# EAGLE design charliewatch-norf (EAGLE 9.4.0)

## Sheet 1 of 2
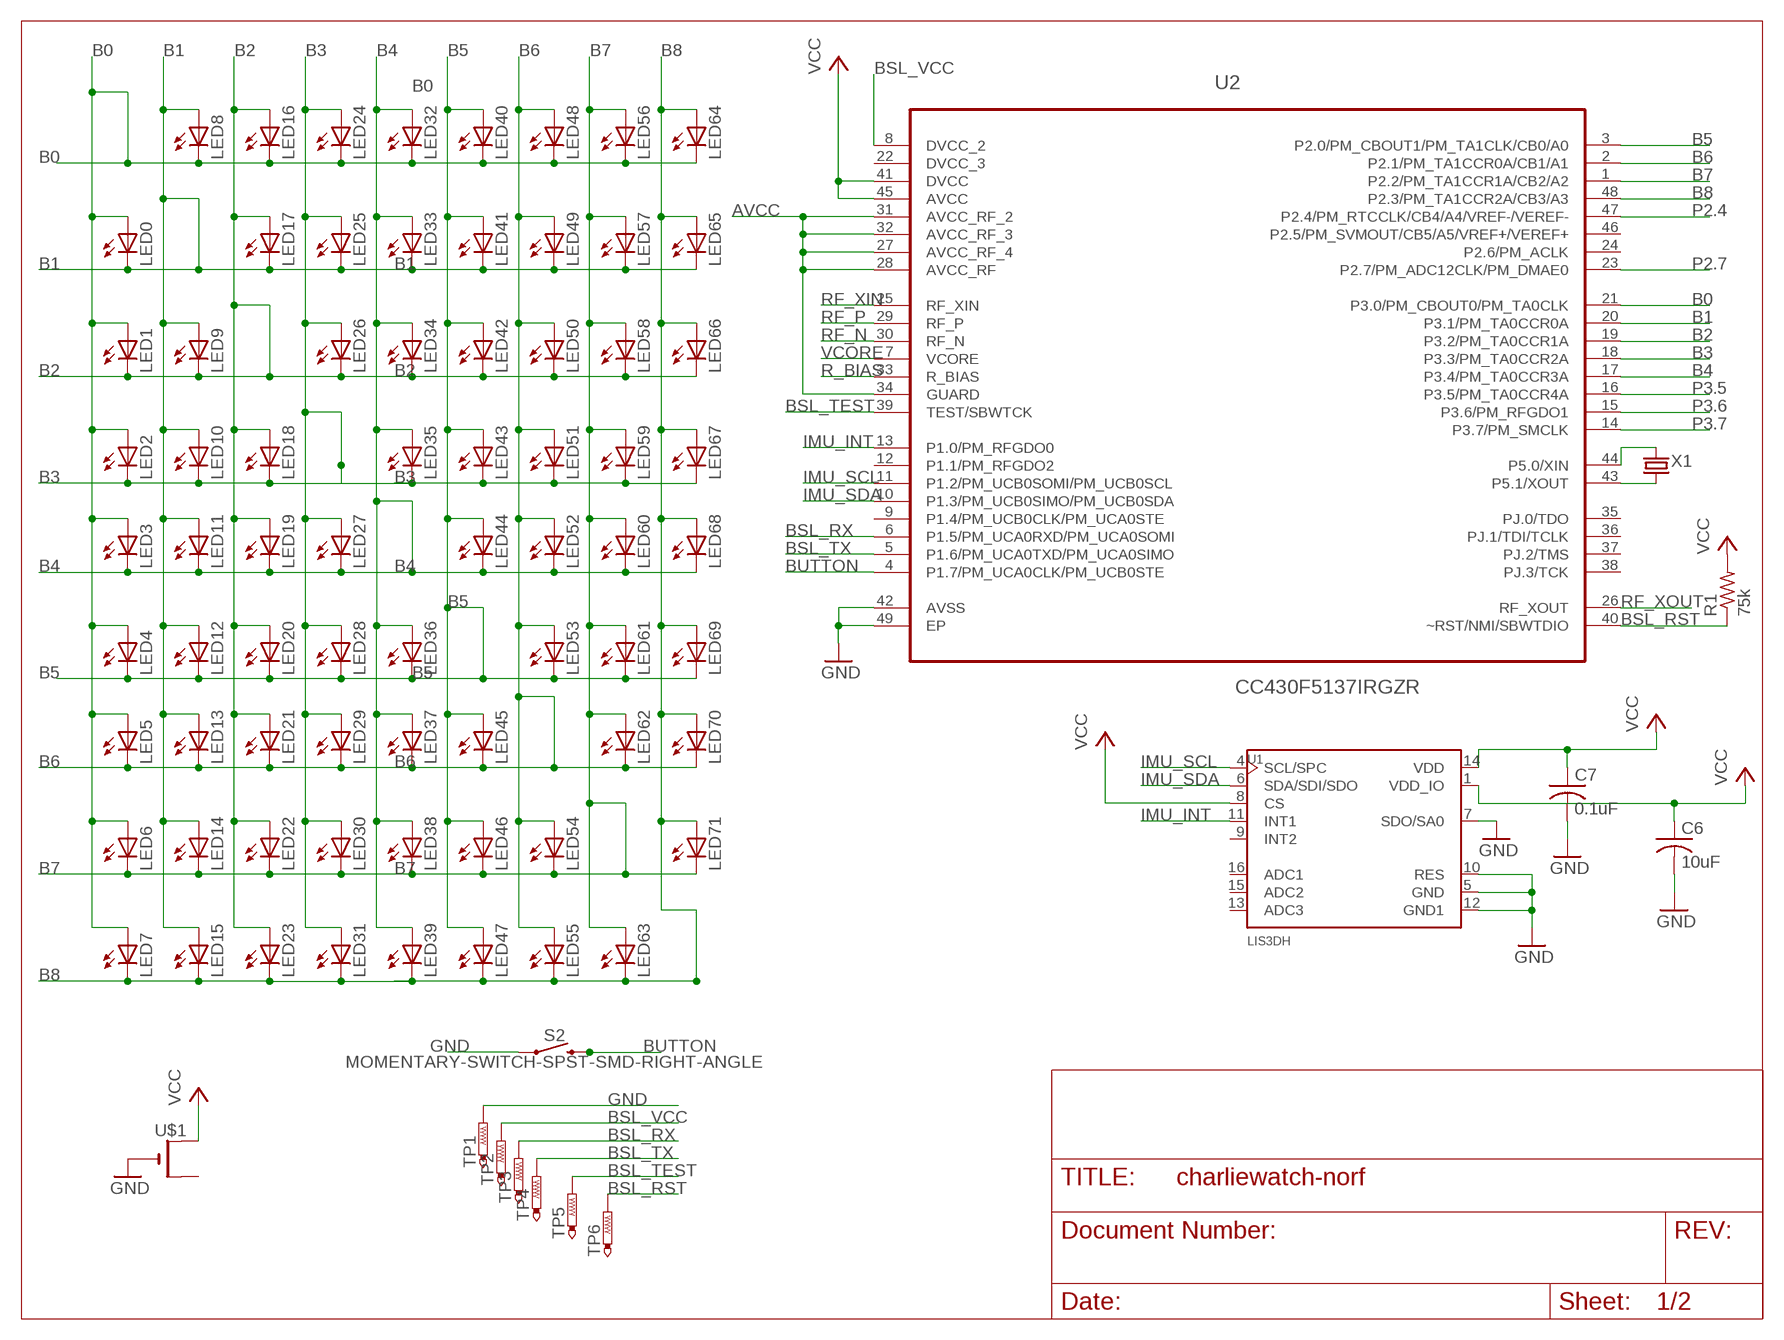
[diagram p0: schematic, sheet 1]

### Parts
C6  10uF  C-USC0603  [C0603]
C7  0.1uF  C-USC0603  [C0603]
LED0  LEDCHIPLED_0603  [CHIPLED_0603]
LED1  LEDCHIPLED_0603  [CHIPLED_0603]
LED2  LEDCHIPLED_0603  [CHIPLED_0603]
LED3  LEDCHIPLED_0603  [CHIPLED_0603]
LED4  LEDCHIPLED_0603  [CHIPLED_0603]
LED5  LEDCHIPLED_0603  [CHIPLED_0603]
LED6  LEDCHIPLED_0603  [CHIPLED_0603]
LED7  LEDCHIPLED_0603  [CHIPLED_0603]
LED8  LEDCHIPLED_0603  [CHIPLED_0603]
LED9  LEDCHIPLED_0603  [CHIPLED_0603]
LED10  LEDCHIPLED_0603  [CHIPLED_0603]
LED11  LEDCHIPLED_0603  [CHIPLED_0603]
LED12  LEDCHIPLED_0603  [CHIPLED_0603]
LED13  LEDCHIPLED_0603  [CHIPLED_0603]
LED14  LEDCHIPLED_0603  [CHIPLED_0603]
LED15  LEDCHIPLED_0603  [CHIPLED_0603]
LED16  LEDCHIPLED_0603  [CHIPLED_0603]
LED17  LEDCHIPLED_0603  [CHIPLED_0603]
LED18  LEDCHIPLED_0603  [CHIPLED_0603]
LED19  LEDCHIPLED_0603  [CHIPLED_0603]
LED20  LEDCHIPLED_0603  [CHIPLED_0603]
LED21  LEDCHIPLED_0603  [CHIPLED_0603]
LED22  LEDCHIPLED_0603  [CHIPLED_0603]
LED23  LEDCHIPLED_0603  [CHIPLED_0603]
LED24  LEDCHIPLED_0603  [CHIPLED_0603]
LED25  LEDCHIPLED_0603  [CHIPLED_0603]
LED26  LEDCHIPLED_0603  [CHIPLED_0603]
LED27  LEDCHIPLED_0603  [CHIPLED_0603]
LED28  LEDCHIPLED_0603  [CHIPLED_0603]
LED29  LEDCHIPLED_0603  [CHIPLED_0603]
LED30  LEDCHIPLED_0603  [CHIPLED_0603]
LED31  LEDCHIPLED_0603  [CHIPLED_0603]
LED32  LEDCHIPLED_0603  [CHIPLED_0603]
LED33  LEDCHIPLED_0603  [CHIPLED_0603]
LED34  LEDCHIPLED_0603  [CHIPLED_0603]
LED35  LEDCHIPLED_0603  [CHIPLED_0603]
LED36  LEDCHIPLED_0603  [CHIPLED_0603]
LED37  LEDCHIPLED_0603  [CHIPLED_0603]
LED38  LEDCHIPLED_0603  [CHIPLED_0603]
LED39  LEDCHIPLED_0603  [CHIPLED_0603]
LED40  LEDCHIPLED_0603  [CHIPLED_0603]
LED41  LEDCHIPLED_0603  [CHIPLED_0603]
LED42  LEDCHIPLED_0603  [CHIPLED_0603]
LED43  LEDCHIPLED_0603  [CHIPLED_0603]
LED44  LEDCHIPLED_0603  [CHIPLED_0603]
LED45  LEDCHIPLED_0603  [CHIPLED_0603]
LED46  LEDCHIPLED_0603  [CHIPLED_0603]
LED47  LEDCHIPLED_0603  [CHIPLED_0603]
LED48  LEDCHIPLED_0603  [CHIPLED_0603]
LED49  LEDCHIPLED_0603  [CHIPLED_0603]
LED50  LEDCHIPLED_0603  [CHIPLED_0603]
LED51  LEDCHIPLED_0603  [CHIPLED_0603]
LED52  LEDCHIPLED_0603  [CHIPLED_0603]
LED53  LEDCHIPLED_0603  [CHIPLED_0603]
LED54  LEDCHIPLED_0603  [CHIPLED_0603]
LED55  LEDCHIPLED_0603  [CHIPLED_0603]
LED56  LEDCHIPLED_0603  [CHIPLED_0603]
LED57  LEDCHIPLED_0603  [CHIPLED_0603]
LED58  LEDCHIPLED_0603  [CHIPLED_0603]
LED59  LEDCHIPLED_0603  [CHIPLED_0603]
LED60  LEDCHIPLED_0603  [CHIPLED_0603]
LED61  LEDCHIPLED_0603  [CHIPLED_0603]
LED62  LEDCHIPLED_0603  [CHIPLED_0603]
LED63  LEDCHIPLED_0603  [CHIPLED_0603]
LED64  LEDCHIPLED_0603  [CHIPLED_0603]
LED65  LEDCHIPLED_0603  [CHIPLED_0603]
LED66  LEDCHIPLED_0603  [CHIPLED_0603]
LED67  LEDCHIPLED_0603  [CHIPLED_0603]
LED68  LEDCHIPLED_0603  [CHIPLED_0603]
LED69  LEDCHIPLED_0603  [CHIPLED_0603]
LED70  LEDCHIPLED_0603  [CHIPLED_0603]
LED71  LEDCHIPLED_0603  [CHIPLED_0603]
R1  75k  R-US_R0402  [R0402]
S2  MOMENTARY-SWITCH-SPST-SMD-RIGHT-ANGLE  [TACTILE_SWITCH_SMD_RIGHT_ANGLE]
TP1  PTR1TP10SQ  [TP10SQ]
TP2  PTR1TP10R  [TP10R]
TP3  PTR1TP10R  [TP10R]
TP4  PTR1TP10R  [TP10R]
TP5  PTR1TP10R  [TP10R]
TP6  PTR1TP10R  [TP10R]
U1  LIS3DH  [PQFN50P300X300X100-16N]
U2  CC430F5137IRGZR  [QFN50P700X700X100-49N]
U$1  CR2032SMT  [CR2032-SMD]
X1  CRYSTALS-NOGND-IQXC-25  [2.0X1.2-2PAD]

### Nets
AVCC: U2.27(AVCC_RF_4) U2.28(AVCC_RF) U2.31(AVCC_RF_2) U2.32(AVCC_RF_3) U2.34(GUARD)
B0: LED0.A LED1.A LED2.A LED3.A LED4.A LED5.A LED6.A LED7.A LED8.C LED16.C LED24.C LED32.C LED40.C LED48.C LED56.C LED64.C U2.21(P3.0/PM_CBOUT0/PM_TA0CLK)
B1: LED0.C LED8.A LED9.A LED10.A LED11.A LED12.A LED13.A LED14.A LED15.A LED17.C LED25.C LED33.C LED41.C LED49.C LED57.C LED65.C U2.20(P3.1/PM_TA0CCR0A)
B2: LED1.C LED9.C LED16.A LED17.A LED18.A LED19.A LED20.A LED21.A LED22.A LED23.A LED26.C LED34.C LED42.C LED50.C LED58.C LED66.C U2.19(P3.2/PM_TA0CCR1A)
B3: LED2.C LED10.C LED18.C LED24.A LED25.A LED26.A LED27.A LED28.A LED29.A LED30.A LED31.A LED35.C LED43.C LED51.C LED59.C LED67.C U2.18(P3.3/PM_TA0CCR2A)
B4: LED3.C LED11.C LED19.C LED27.C LED32.A LED33.A LED34.A LED35.A LED36.A LED37.A LED38.A LED39.A LED44.C LED52.C LED60.C LED68.C U2.17(P3.4/PM_TA0CCR3A)
B5: LED4.C LED12.C LED20.C LED28.C LED36.C LED40.A LED41.A LED42.A LED43.A LED44.A LED45.A LED46.A LED47.A LED53.C LED61.C LED69.C U2.3(P2.0/PM_CBOUT1/PM_TA1CLK/CB0/A0)
B6: LED5.C LED13.C LED21.C LED29.C LED37.C LED45.C LED48.A LED49.A LED50.A LED51.A LED52.A LED53.A LED54.A LED55.A LED62.C LED70.C U2.2(P2.1/PM_TA1CCR0A/CB1/A1)
B7: LED6.C LED14.C LED22.C LED30.C LED38.C LED46.C LED54.C LED56.A LED57.A LED58.A LED59.A LED60.A LED61.A LED62.A LED63.A LED71.C U2.1(P2.2/PM_TA1CCR1A/CB2/A2)
B8: LED7.C LED15.C LED23.C LED31.C LED39.C LED47.C LED55.C LED63.C LED64.A LED65.A LED66.A LED67.A LED68.A LED69.A LED70.A LED71.A U2.48(P2.3/PM_TA1CCR2A/CB3/A3)
BSL_RST: R1.1 TP6.TP U2.40(~RST/NMI/SBWTDIO)
BSL_RX: TP3.TP U2.6(P1.5/PM_UCA0RXD/PM_UCA0SOMI)
BSL_TEST: TP5.TP U2.39(TEST/SBWTCK)
BSL_TX: TP4.TP U2.5(P1.6/PM_UCA0TXD/PM_UCA0SIMO)
BSL_VCC: TP2.TP U2.8(DVCC_2)
BUTTON: S2.2 U2.4(P1.7/PM_UCA0CLK/PM_UCB0STE)
GND: C6.2 C7.2 S2.1 TP1.TP U1.5(GND) U1.7(SDO/SA0) U1.10(RES) U1.12(GND1) U2.42(AVSS) U2.49(EP) U$1.-
IMU_INT: U1.11(INT1) U2.13(P1.0/PM_RFGDO0)
IMU_SCL: U1.4(SCL/SPC) U2.11(P1.2/PM_UCB0SOMI/PM_UCB0SCL)
IMU_SDA: U1.6(SDA/SDI/SDO) U2.10(P1.3/PM_UCB0SIMO/PM_UCB0SDA)
P2.4: U2.47(P2.4/PM_RTCCLK/CB4/A4/VREF-/VEREF-)
P2.7: U2.23(P2.7/PM_ADC12CLK/PM_DMAE0)
P3.5: U2.16(P3.5/PM_TA0CCR4A)
P3.6: U2.15(P3.6/PM_RFGDO1)
P3.7: U2.14(P3.7/PM_SMCLK)
R_BIAS: U2.33(R_BIAS)
RF_N: U2.30(RF_N)
RF_P: U2.29(RF_P)
RF_XIN: U2.25(RF_XIN)
RF_XOUT: U2.26(RF_XOUT)
VCC: C6.1 C7.1 R1.2 U1.1(VDD_IO) U1.8(CS) U1.14(VDD) U2.41(DVCC) U2.45(AVCC) U$1.+$1(+)
VCORE: U2.7(VCORE)
XIN: U2.44(P5.0/XIN) X1.2
XOUT: U2.43(P5.1/XOUT) X1.1
Unconnected: U1.9(INT2) U1.13(ADC3) U1.15(ADC2) U1.16(ADC1) U2.9(P1.4/PM_UCB0CLK/PM_UCA0STE) U2.12(P1.1/PM_RFGDO2) U2.24(P2.6/PM_ACLK) U2.35(PJ.0/TDO) U2.36(PJ.1/TDI/TCLK) U2.37(PJ.2/TMS) U2.38(PJ.3/TCK) U2.46(P2.5/PM_SVMOUT/CB5/A5/VREF+/VEREF+) U$1.+$2(+1)

## Sheet 2 of 2

## Power pins joined to a net without a drawn wire
DVCC_3: U2.22(DVCC_3)

## Library data of the parts
C6 C7 = resistor:C-US: CAPACITOR, American symbol
LED0 LED1-LED71 = led:LED: LED OSRAM: - CHIPLED LG R971, LG N971, LY N971, LG Q971, LY Q971, LO R971, LY R971 LH N974, LH R974 LS Q976, LO Q976, LY Q976 LO Q996 - Hyper CHIPLED LW Q18S LB Q993, LB Q99A, LB R99A - SideLED LS A670, LO A670, LY A670, LG A670, LP A670 LB A673, LV A673, LT A673, LW A673 LH A674 LY A675 LS A676, LA A676, LO A676, LY A676, LW A676 LS A679, LY A679, LG A679 - Hyper Micro SIDELED® LS Y876, LA Y876, LO Y876, LY Y876 LT Y87S - SmartLED LW L88C, LW L88S LB L89C, LB L89S, LG L890 LS L89K, LO L89K, LY L89K LS L896, LA L896, LO L896, LY L896 - TOPLED LS T670, LO T670, LY T670, LG T670, LP T670 LSG T670, LSP T670, LSY T670, LOP T670, LYG T670 LG T671, LOG T671, LSG T671 LB T673, LV T673, LT T673, LW T673 LH T674 LS T676, LA T676, LO T676, LY T676, LB T676, LH T676, LSB T676, LW T676 LB T67C, LV T67C, LT T67C, LS T67K, LO T67K, LY T67K, LW E67C LS E67B, LA E67B, LO E67B, LY E67B, LB E67C, LV E67C, LT E67C LW T67C LS T679, LY T679, LG T679 LS T770, LO T770, LY T770, LG T770, LP T770 LB T773, LV T773, LT T773, LW T773 LH T774 LS E675, LA E675, LY E675, LS T675 LS T776, LA T776, LO T776, LY T776, LB T776 LHGB T686 LT T68C, LB T68C - Hyper Mini TOPLED® LB M676 - Mini TOPLED Santana® LG M470 LS M47K, LO M47K, LY M47K Source: http://www.osram.convergy.de LUXEON: - LUMILED® LXK2-PW12-R00, LXK2-PW12-S00, LXK2-PW14-U00, LXK2-PW14-V00 LXK2-PM12-R00, LXK2-PM12-S00, LXK2-PM14-U00 LXK2-PE12-Q00, LXK2-PE12-R00, LXK2-PE12-S00, LXK2-PE14-T00, LXK2-PE14-U00 LXK2-PB12-K00, LXK2-PB12-L00, LXK2-PB12-M00, LXK2-PB14-N00, LXK2-PB14-P00, LXK2-PB14-Q00 LXK2-PR12-L00, LXK2-PR12-M00, LXK2-PR14-Q00, LXK2-PR14-R00 LXK2-PD12-Q00, LXK2-PD12-R00, LXK2-PD12-S00 LXK2-PH12-R00, LXK2-PH12-S00 LXK2-PL12-P00, LXK2-PL12-Q00, LXK2-PL12-R00 Source: www.luxeon.com KINGBRIGHT: KA-3528ASYC Source: www.kingbright.com
R1 = rcl:R-US_: RESISTOR, American symbol
S2 = SparkFun-Switches:MOMENTARY-SWITCH-SPST: Momentary Switch (Pushbutton) - SPST Normally-open (NO) SPST momentary switches (buttons, pushbuttons). Variants PTH-12MM - 12mm square, through-hole Momentary Pushbutton Switch - 12mm Square <https://www.sparkfun.com/products/9190> (COM-09190) PTH-6.0MM, PTH-6.0MM-KIT - 6.0mm square, through-hole Mini Pushbutton Switch <https://www.sparkfun.com/products/97> (COM-00097) KIT package intended for soldering kit's - only one side of pads' copper is exposed. PTH-RIGHT-ANGLE-KIT - Right-angle, through-hole Right Angle Tactile Button <https://www.sparkfun.com/products/10791> - Used on SparkFun BigTime Watch Kit <https://www.sparkfun.com/products/11734> SMD-12MM - 12mm square, surface-mount Tactile Button - SMD (12mm) <https://www.sparkfun.com/products/12993> (COM-12993) Used on SparkFun PicoBoard <https://www.sparkfun.com/products/11888> SMD-4.5MM - 4.5mm Square Trackball Switch Used on SparkFun Blackberry Trackballer Breakout <https://www.sparkfun.com/products/13169> SMD-4.6MMX2.8MM - 4.60mm x 2.80mm, surface mount Used on SparkFun SAMD21 Mini Breakout <https://www.sparkfun.com/products/13664> SMD-5.2MM, SMD-5.2-REDUNDANT - 5.2mm square, surface-mount Mini Pushbutton Switch - SMD <https://www.sparkfun.com/products/8720> (COM-08720) Used on Arduino Pro Mini <https://www.sparkfun.com/products/11114> REDUNDANT package connects both switch circuits together SMD-6.0X3.5MM - 6.0 x 3.5mm, surface mount Momentary Reset Switch SMD <https://www.sparkfun.com/products/8229> (COM-08229) SMD-6.2MM-TALL - 6.2mm square, surface mount Tactile Button - SMD (6mm) <https://www.sparkfun.com/products/12992> Used on SparkFun Digital Sandbox <https://www.sparkfun.com/products/12651> SMD-RIGHT-ANGLE - Right-angle, surface mount Used on SparkFun Block for Intel® Edison - Arduino <https://www.sparkfun.com/products/13036>; PROD_ID: COMP-12265
TP1-TP6 = testpad:PTR1: TEST PIN
U1 = LIS3DH:LIS3DH: MEMS digital output motion sensor ultra low-power high performance 3-axes "nano" accelerometer; AVAILABILITY: Unavailable; DESCRIPTION: MEMS digital output motion sensor ultra low-power high performance 3-axes nano accelerometer; MF: STMicroelectronics; MP: LIS3DH; PACKAGE: LGA-16 STMicroelectronics; PRICE: None
U2 = Texas Instruments_By_element14_Batch_1:CC430F5137IRGZR: MSP430 SoC with RF Core; MPN: CC430F5137IRGZR; OC_FARNELL: -; OC_NEWARK: 68R5912; PACKAGE: QFN-48; SUPPLIER: TEXAS INSTRUMENTS
U$1 = adafruit:CR2032
X1 = IQD-Frequency-Products:CRYSTALS-NOGND: CRYSTALS CAN NOT GROUNDED

## Net classes
0 default: width 0.102 mm, drill 0.025 mm, clearance 0.025 mm

## Board
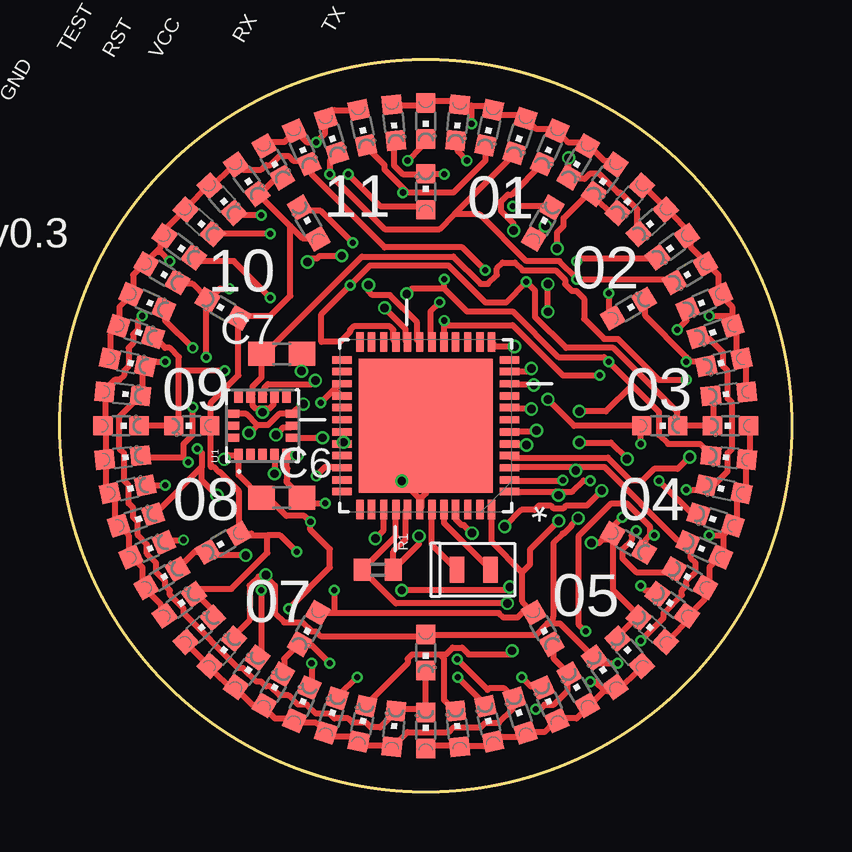
[diagram p1: board, top side]
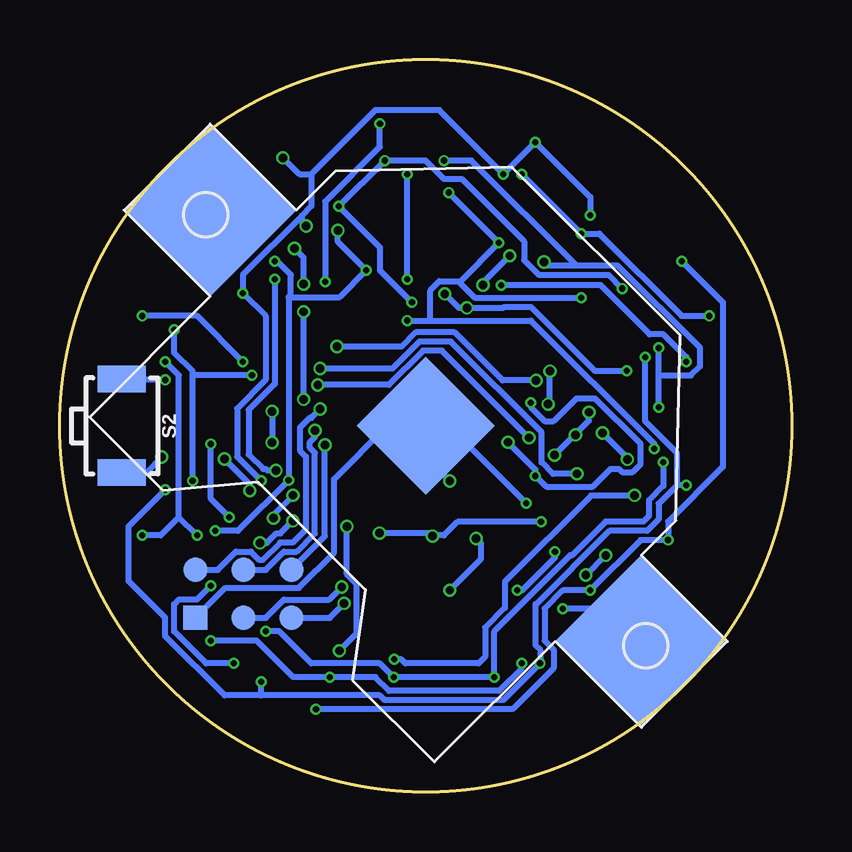
[diagram p2: board, bottom side, seen from below]

Size 30.48 x 30.48 mm. Coordinates in mm from the lower left corner, seen from the top.
Outline: circle at 15.24,15.24 radius 15.24
Copper layers (1*16): Top 0.035mm / dielectric 1.5mm / Bottom 0.035mm
Design rules "default *": minimum track width 10mil, minimum drill 10mil, track to track 5mil, track to pad 5mil, pad to pad 5mil, via to via 5mil, smd to smd 5mil, copper to edge 40mil, drill to drill 8mil, minimum pad ring 10mil, minimum via ring 4mil, stop-mask expansion 4mil, vias tented up to drill 15mil, thermal gap 10mil

### Footprints (pad centres in the part's own frame; a part is rotated, then mirrored left to right if it is on the bottom)
C0603 = smd 1.1 x 1: 1 -0.85,0; 2 0.85,0
CHIPLED_0603 = smd 0.8 x 0.8: A 0,-0.75; C 0,0.75
R0402 = smd 0.7 x 0.9: 1 -0.65,0; 2 0.65,0
TACTILE_SWITCH_SMD_RIGHT_ANGLE = smd 1.1 x 2: 1 -1.95,0; 2 1.95,0
TP10SQ = smd 1 x 1: TP 0,0
TP10R = smd 1 x 1: TP 0,0
PQFN50P300X300X100-16N = smd 0.52 x 0.35: 1 -1.225,1; 2 -1.225,0.5; 3 -1.225,0; 4 -1.225,-0.5; 5 -1.225,-1; 9 1.225,-1; 10 1.225,-0.5; 11 1.225,0; 12 1.225,0.5; 13 1.225,1 | smd 0.35 x 0.52: 6 -0.5,-1.225; 7 0,-1.225; 8 0.5,-1.225; 14 0.5,1.225; 15 0,1.225; 16 -0.5,1.225
QFN50P700X700X100-49N = smd 0.813 x 0.305: 1 -3.48,2.743; 2 -3.48,2.261; 3 -3.48,1.753; 4 -3.48,1.245; 5 -3.48,0.762; 6 -3.48,0.254; 7 -3.48,-0.254; 8 -3.48,-0.762; 9 -3.48,-1.245; 10 -3.48,-1.753; 11 -3.48,-2.261; 12 -3.48,-2.743; 25 3.48,-2.743; 26 3.48,-2.261; 27 3.48,-1.753; 28 3.48,-1.245; 29 3.48,-0.762; 30 3.48,-0.254; 31 3.48,0.254; 32 3.48,0.762; 33 3.48,1.245; 34 3.48,1.753; 35 3.48,2.261; 36 3.48,2.743 | smd 0.305 x 0.813: 13 -2.743,-3.48; 14 -2.261,-3.48; 15 -1.753,-3.48; 16 -1.245,-3.48; 17 -0.762,-3.48; 18 -0.254,-3.48; 19 0.254,-3.48; 20 0.762,-3.48; 21 1.245,-3.48; 22 1.753,-3.48; 23 2.261,-3.48; 24 2.743,-3.48; 37 2.743,3.48; 38 2.261,3.48; 39 1.753,3.48; 40 1.245,3.48; 41 0.762,3.48; 42 0.254,3.48; 43 -0.254,3.48; 44 -0.762,3.48; 45 -1.245,3.48; 46 -1.753,3.48; 47 -2.261,3.48; 48 -2.743,3.48 | smd 5.588 x 5.588: 49 0,0
CR2032-SMD = smd 5.08 x 5.08: +$1 -12.7,0; +$2 12.7,0 | smd 4.064 x 4.064: - 0,0
2.0X1.2-2PAD = smd 0.6 x 1.1: 1 -0.7,0; 2 0.7,0

### Placement (x,y rotation side)
C6  9.24,12.24 0 top
C7  9.24,18.24 180 top
LED0  13.91,27.87 186 top
LED1  15.24,27.94 180 top
LED2  16.57,27.87 174 top
LED3  17.88,27.66 168 top
LED4  19.16,27.32 162 top
LED5  20.41,26.84 156 top
LED6  21.59,26.24 150 top
LED7  22.71,25.51 144 top
LED8  27.87,16.57 96 top
LED9  27.66,17.88 102 top
LED10  27.32,19.16 108 top
LED11  26.84,20.41 114 top
LED12  26.24,21.59 120 top
LED13  25.51,22.71 126 top
LED14  24.68,23.74 132 top
LED15  23.74,24.68 138 top
LED16  27.94,15.24 90 top
LED17  27.87,13.91 84 top
LED18  27.66,12.6 78 top
LED19  27.32,11.32 72 top
LED20  26.84,10.07 66 top
LED21  26.24,8.89 60 top
LED22  25.51,7.77 54 top
LED23  24.68,6.74 48 top
LED24  15.24,2.54 0 top
LED25  16.57,2.61 6 top
LED26  17.88,2.82 12 top
LED27  19.16,3.16 18 top
LED28  20.41,3.64 24 top
LED29  21.59,4.24 30 top
LED30  22.71,4.97 36 top
LED31  23.74,5.8 42 top
LED32  13.91,2.61 354 top
LED33  12.6,2.82 348 top
LED34  11.32,3.16 342 top
LED35  10.07,3.64 336 top
LED36  8.89,4.24 330 top
LED37  7.77,4.97 324 top
LED38  6.74,5.8 318 top
LED39  5.8,6.74 312 top
LED40  2.61,16.57 264 top
LED41  2.54,15.24 270 top
LED42  2.61,13.91 276 top
LED43  2.82,12.6 282 top
LED44  3.16,11.32 288 top
LED45  3.64,10.07 294 top
LED46  4.24,8.89 300 top
LED47  4.97,7.77 306 top
LED48  2.82,17.88 258 top
LED49  3.16,19.16 252 top
LED50  3.64,20.41 246 top
LED51  4.24,21.59 240 top
LED52  4.97,22.71 234 top
LED53  5.8,23.74 228 top
LED54  6.74,24.68 222 top
LED55  7.77,25.51 216 top
LED56  15.24,5.79 180 top
LED57  15.24,24.99 0 top
LED58  23.68,20.11 300 top
LED59  20.11,23.68 330 top
LED60  12.6,27.66 192 top
LED61  11.32,27.32 198 top
LED62  10.07,26.84 204 top
LED63  8.89,26.24 210 top
LED64  24.99,15.24 270 top
LED65  5.49,15.24 90 top
LED66  23.68,10.37 240 top
LED67  6.8,20.11 60 top
LED68  10.37,23.68 30 top
LED69  10.37,6.8 150 top
LED70  20.11,6.8 210 top
LED71  6.8,10.37 120 top
R1  13.24,9.24 0 top
S2  27.9,15.24 270 bottom
TP1  24.84,7.24 180 bottom
TP2  24.84,9.24 0 bottom
TP3  22.84,9.24 0 bottom
TP4  20.84,9.24 0 bottom
TP5  22.84,7.24 0 bottom
TP6  20.84,7.24 0 bottom
U1  8.44,15.24 90 top
U2  15.24,15.24 180 top
U$1  15.24,15.24 135 bottom
X1  17.24,9.24 0 top

### Tracks (layer width: path | path; a pad name or v marks a point on that pad's centre or on a via)
AVCC  (via drill 0.25, 0.35)
  Top 0.254: v10.67,13.15 11.05,13.53 11.62,13.53 U2.34 | 11.43,16.77 11.62,16.96 U2.27 | 11.43,16.77 v10.86,16.2 | 11.43,16.77 11.62,16.58 U2.28 | U2.31 11.81,14.86 v11.81,14.55 11.81,14.53 U2.32
  Bottom 0.254: v10.86,16.2 10.86,16.01 10.29,15.43 9.91,15.43 8.96,16.38 8.19,16.38 6.29,14.48 6.29,13.64 6.62,13.31 7.06,13.31 7.19,13.44 7.54,13.44 8.27,12.71 10.23,12.71 v10.67,13.15 10.67,13.41 v11.81,14.55
B0  (via drill 0.25)
  Top 0.254: LED7.A 23.05,26.29 22.67,26.29 22.1,26.86 LED6.A 21.91,27.05 21.15,27.05 20.77,27.43 LED5.A 20.58,27.62 19.81,27.62 19.43,28.01 LED4.A 19.24,28.2 18.29,28.2 18.1,28.39 LED3.A 17.91,28.58 17.15,28.58 | LED0.A 13.91,28.58 15.05,28.58 LED1.A 15.24,28.77 16.58,28.77 LED2.A 16.77,28.58 17.15,28.58 | LED8.C 27.24,16.38 27.24,15.24 LED16.C 27.05,15.24 25.91,15.24 LED64.C 25.72,15.24 25.72,15.81 23.05,18.48 21.09,18.48 19.8,19.77 19.8,20.87 v19.43,21.24 18.58,20.39 17.72,20.39 16.2,21.91 12.91,21.91 v12.1,21.1 10.89,19.9 10.89,18.74 11.64,18.74 11.66,18.72 12.09,19.15 12.09,19.23 12.24,19.38 13.74,19.38 13.89,19.23 13.89,18.82 U2.21 | v17.15,27.82 17.15,28.58 | LED56.C 15.24,4.96 15.24,3.43 LED24.C 15.05,3.43 14.1,3.43 LED32.C 13.91,3.24 13.34,2.67 12.96,2.67 12.77,2.86 12.19,2.86 12,3.05 11.43,3.05 11.24,3.24 10.67,3.24 10.29,3.62 9.91,3.62 9.53,4 9.15,4 8.77,4.38 8.58,4.38 8.38,4.58 8.19,4.58 7.62,5.15 7.43,5.15 5.15,7.43 5.15,7.62 4.58,8.19 4.58,8.38 4.38,8.58 4.38,8.77 4,9.15 4,9.53 3.62,9.91 3.62,10.29 3.24,10.67 3.24,11.24 3.05,11.43 3.05,11.81 2.86,12 2.86,12.77 2.67,12.96 2.67,14.1 2.48,14.29 2.48,15.62 3.24,16.38 LED40.C 3.43,16.58 3.43,17.72 LED48.C 3.62,17.91 v4.38,17.91
  Bottom 0.254: v17.15,27.82 17.15,26.86 19.43,24.58 v19.43,21.24 | v12.1,21.1 7.95,21.1 5.91,19.05 5.34,19.05 4.38,18.1 v4.38,17.91
B1  (via drill 0.25, 0.35)
  Top 0.254: LED8.A 28.58,16.77 28.58,17.91 LED9.A 28.39,18.1 28.2,18.29 28.2,19.24 LED10.A 28.01,19.43 28.01,19.81 | LED15.A 24.39,25.15 25.15,24.39 LED14.A 25.34,24.2 26.29,23.24 LED13.A 26.29,23.05 26.29,22.67 26.86,22.1 LED12.A 27.05,21.91 27.43,21.53 27.43,20.77 LED11.A 27.62,20.58 28.01,20.2 28.01,19.81 | LED41.C 3.43,15.24 4.58,15.24 LED65.C 4.77,15.24 4.96,15.43 4.96,17.53 | 4.96,17.53 4.96,18.1 4.58,18.48 4.38,18.48 4,18.86 LED49.C | LED0.C 13.91,27.05 13.91,26.1 14.29,25.72 15.05,25.72 LED57.C 15.24,25.72 v16.01,25.72 | 23.84,16.94 v22.86,17.91 22.67,18.1 20.77,18.1 18.86,20.01 16.96,20.01 16.01,20.96 | 23.84,16.94 24.96,15.81 24.96,14.86 25.34,14.48 26.67,14.48 27.05,14.1 LED17.C | 16.01,20.96 v16.01,21.34 | v6.86,17.53 4.96,17.53 | v27.05,19.81 28.01,19.81 | 15.81,5.72 14.67,5.72 14.48,5.53 14.48,5.34 12.77,3.62 LED33.C | 15.81,5.72 16.01,5.53 16.01,3.81 16.38,3.43 LED25.C | U2.20 14.4,18.8 14.4,19.26 13.53,20.14 v13.53,20.16 | v14.45,20.74 14.67,20.96 16.01,20.96 | 15.81,5.72 16.08,5.72 16.36,5.99 16.76,5.99 17.03,5.72 18.84,5.72 v18.84,5.87 | 23.84,16.94 22.74,15.84 v21.64,15.84 | v21.64,14.54 22.95,14.54 v23.63,13.86 | v22.57,12.54 21.96,11.92 21.1,11.92 20.99,11.81 20.55,11.81 20.44,11.92 19.96,11.92 19.78,11.74 19.23,11.74 v18.53,11.04
  Bottom 0.254: v16.01,21.34 v16.01,25.72 | v6.86,17.53 8.19,17.53 10.86,20.2 11.98,20.2 12.02,20.16 v13.53,20.16 13.87,20.16 v14.45,20.74 | v27.05,19.81 24.77,19.81 v22.86,17.91 | v18.53,11.04 18.53,9.06 18.11,8.64 18.11,6.6 v18.84,5.87 | v21.64,15.84 v21.64,14.54 | v23.63,13.86 22.58,12.81 22.58,12.76 22.57,12.75 v22.57,12.54
B2  (via drill 0.25, 0.35)
  Top 0.254: LED23.A 25.34,6.29 26.29,7.24 LED22.A 26.29,7.43 26.86,8 26.86,8.38 LED21.A 27.05,8.58 27.05,9.34 27.43,9.72 LED20.A 27.62,9.91 27.62,10.67 | 27.62,10.67 28.01,11.05 LED19.A 28.2,11.24 28.2,12.19 28.39,12.38 LED18.A 28.58,12.58 28.58,13.72 LED17.A 28.77,13.91 28.77,15.05 LED16.A | 26.1,18.1 26.29,17.91 26.86,17.91 LED9.C | 26.1,18.1 24.39,19.81 24.39,20.39 LED58.C | v16.58,4.77 17.72,3.62 LED26.C | v12.38,4.77 11.62,4 LED34.C | 24.58,10.67 24.39,10.48 24.39,10.1 LED66.C | 24.58,10.67 24.58,11.05 23.62,12 22.97,12 21.6,10.63 21.6,6.98 v21.91,6.67 | 5.15,13.91 3.43,13.91 LED42.C | v5.34,13.72 5.15,13.91 | v5.53,18.48 4.38,19.62 4.38,20.01 LED50.C | v5.53,16.01 5.53,14.86 5.15,14.48 5.15,13.91 | v14.48,26.29 15.05,26.86 15.05,27.05 LED1.C | v26.1,17.91 26.1,18.1 | 24.58,10.67 v24.77,10.67 | v27.05,10.67 27.62,10.67 | v12.86,21.11 12.86,20.85 13.02,20.69 13.75,20.69 14.88,19.55 14.88,18.82 U2.19 | v11.74,22.32 10.82,22.32 10.71,22.21 10.46,22.21 v10.31,22.06
  Bottom 0.254: v21.91,6.67 21.34,6.67 20.01,5.34 17.15,5.34 v16.58,4.77 v12.38,4.77 12.38,6.67 9.21,9.85 9.14,9.85 7.75,11.24 6.18,11.24 5.94,11.48 5.94,12.14 5.93,12.14 5.34,12.73 v5.34,13.72 | v5.53,16.01 5.53,17.34 | 5.53,17.34 v5.53,18.48 | v14.48,26.29 13.34,26.29 8.96,21.91 | 8.96,21.91 7.24,21.91 3.81,18.48 3.81,17.72 4.19,17.34 5.53,17.34 | v26.1,17.91 25.53,17.34 25.53,11.43 | v24.77,10.67 25.53,11.43 | v27.05,10.67 26.29,10.67 25.53,11.43 | v12.86,21.11 12.86,21.21 v11.74,22.32 | 8.96,21.91 10.16,21.91 v10.31,22.06
B3  (via drill 0.25)
  Top 0.254: v16.96,26.29 16.58,26.67 16.58,27.05 LED2.C | v18.86,24.39 20.39,24.39 LED59.C | v15.81,20.39 15.43,20.01 15.43,18.86 U2.18 | LED24.A 15.24,1.91 16.58,1.91 LED25.A 16.77,1.91 17.91,1.91 LED26.A 18.1,2.1 18.29,2.29 19.24,2.29 LED27.A 19.43,2.48 20.2,2.48 20.58,2.86 LED28.A 20.77,3.05 21.53,3.05 21.91,3.43 LED29.A 22.1,3.62 22.67,4.19 | 22.67,4.19 23.05,4.19 LED30.A 23.24,4.19 24.2,5.15 LED31.A | LED10.C 26.67,18.86 27.05,18.86 27.62,18.29 27.62,17.72 27.82,17.53 27.82,16.38 28.01,16.2 28.01,14.29 27.82,14.1 27.82,13.34 27.05,12.58 LED18.C 26.86,12.58 v26.1,12.58 | LED51.C 4.96,21.15 5.53,21.15 6.1,20.58 LED67.C | v10.48,5.34 10.48,4.38 LED35.C | v4.38,12.77 3.62,12.77 LED43.C | v6.1,18.1 6.1,20.39 LED67.C | 22.67,4.19 22.29,4.58 v22.1,4.58 | v7.05,20.96 6.67,20.96 6.29,20.58 LED67.C
  Bottom 0.254: v15.81,20.39 17.15,21.72 17.15,22.67 v18.86,24.39 v16.96,26.29 15.24,26.29 14.48,25.53 13.75,25.53 11.14,22.92 11.14,22.14 10.53,21.53 7.62,21.53 v7.05,20.96 | v4.38,12.77 4.77,12.77 | v6.1,18.1 6.1,15.43 4.77,14.1 4.77,12.77 | v26.1,12.58 27.62,11.05 27.62,8.77 26.1,7.24 26.1,6.48 23.62,4 22.1,4 | 22.1,4 17.15,4 16.96,3.81 12,3.81 v10.48,5.34 10.48,5.91 10.67,6.1 10.67,7.81 10.64,7.81 7.59,10.86 6.02,10.86 5.54,11.34 5.54,11.99 4.77,12.77 | 22.1,4 v22.1,4.58
B4  (via drill 0.25, 0.35)
  Top 0.254: LED39.A 5.34,6.1 6.1,5.34 LED38.A 6.29,5.15 7.24,4.19 LED37.A 7.43,4.19 8,3.62 8.38,3.62 LED36.A 8.58,3.43 8.96,3.05 9.72,3.05 LED35.A 9.91,2.86 10.67,2.86 11.05,2.48 LED34.A 11.24,2.29 12.19,2.29 12.38,2.1 LED33.A 12.58,1.91 13.72,1.91 LED32.A 13.91,1.91 14.48,2.48 16.2,2.48 16.38,2.67 17.53,2.67 17.72,2.86 18.29,2.86 18.86,3.43 18.86,3.81 LED27.C 18.51,4.29 17.88,4.29 17.82,4.24 v16.56,5.5 v16.56,5.51 | v25.72,19.24 26.1,19.62 26.1,20.01 LED11.C | v24.96,12.96 26.48,11.43 LED19.C | 14.29,25.15 14.48,24.96 16.38,24.96 17.72,26.29 17.72,26.86 LED3.C | 14.29,25.15 13.53,25.91 13.53,26.1 12.77,26.86 LED60.C | 5.91,13.53 4,11.62 LED44.C | 5.91,13.53 5.91,14.1 v5.72,14.29 | 16.01,19.43 16.01,18.86 U2.17 | v8.77,20.58 7.24,22.1 5.72,22.1 LED52.C | v12.19,22.86 10.86,24.2 10.1,24.2 LED68.C | v14.29,24.96 14.29,25.15 | v22.48,17.34 20.96,17.34 18.86,19.43 16.01,19.43 | 16.01,19.43 v16.01,19.62 | v6.54,12.34 5.91,12.97 5.91,13.53
  Bottom 0.254: v25.72,19.24 25.72,18.29 24.96,17.53 24.96,17.34 | v24.96,12.96 24.96,17.34 | v5.72,14.29 5.72,14.48 10.86,19.62 15.05,19.62 | v16.01,19.62 15.05,19.62 | v8.77,20.58 13.2,20.58 13.84,21.22 13.79,21.27 | 13.79,21.27 14.67,21.27 15.05,20.89 15.05,19.62 | 13.79,21.27 v12.19,22.86 v14.29,24.96 | v22.48,17.34 24.96,17.34 | v6.54,12.34 8.1,12.34 8.12,12.32 8.35,12.32 11.94,8.74 11.94,7.65 12.77,6.83 12.77,5.61 13.04,5.34 16.09,5.34 16.26,5.51 v16.56,5.51
B5  (via drill 0.25, 0.35)
  Top 0.254: 21.44,13.53 18.86,13.53 U2.3 | 21.44,13.53 22.67,13.53 25.72,10.48 26.1,10.48 LED20.C 26.29,10.29 26.29,9.72 26.48,9.53 26.48,9.15 26.1,8.77 26.1,8.58 25.91,8.38 25.91,8.19 25.15,7.43 25.15,7.24 v24.2,6.29 | LED36.C 9.34,4.96 9.34,5.53 9.91,6.1 LED69.C 10.1,6.1 10.48,6.1 v11.24,5.34 | v19.24,4.77 19.62,4.38 20.01,4.38 LED28.C | LED47.A 4.19,7.43 4.19,7.81 3.62,8.38 LED46.A 3.43,8.58 3.43,9.34 3.05,9.72 LED45.A 2.86,9.91 2.86,10.67 2.48,11.05 LED44.A 2.29,11.24 2.29,12.19 2.1,12.38 LED43.A 1.91,12.58 1.91,13.72 LED42.A 1.91,13.91 1.91,15.05 LED41.A 1.91,15.24 1.91,16.58 LED40.A 1.91,16.77 2.29,17.15 2.48,17.15 2.67,17.34 2.67,17.53 2.86,17.72 2.86,18.48 3.05,18.67 3.05,19.05 3.24,19.24 3.24,19.62 v3.43,19.81 | v8.77,23.24 6.48,23.24 LED53.C | LED61.C 11.43,26.48 11.24,26.29 v11.24,25.72 13.53,23.43 15.81,23.43 16.43,24.05 | LED12.C 25.53,21.34 v21.53,21.34 21.53,21.38 20.8,22.1 19.43,22.1 17.48,24.05 16.43,24.05 | LED4.C 18.86,26.48 16.43,24.05 | v21.49,13.38 21.44,13.43 21.44,13.53
  Bottom 0.254: v11.24,5.34 11.24,5.15 12.19,4.19 16.77,4.19 17.34,4.77 v19.24,4.77 20.77,4.77 22.29,6.29 v24.2,6.29 | v11.24,25.72 v8.77,23.24 8,23.24 4.58,19.81 v3.43,19.81 | v21.53,21.34 21.53,16.99 22.62,15.9 22.62,14.04 22.02,13.44 21.9,13.44 21.84,13.38 v21.49,13.38
B6  (via drill 0.25, 0.35)
  Top 0.254: LED70.C 20.58,6.1 20.58,5.53 21.15,4.96 LED29.C 21.15,4.77 21.15,4.19 20.58,3.62 20.2,3.62 20.01,3.43 v19.81,3.43 | v8.38,8.38 8.38,5.72 LED37.C | v5.15,10.48 4.38,10.48 LED45.C | LED48.A 2.1,18.1 2.1,19.05 2.29,19.24 LED49.A 2.48,19.43 2.48,20.2 2.86,20.58 LED50.A 3.05,20.77 3.05,21.53 3.43,21.91 LED51.A 3.62,22.1 4,22.48 | 4,22.48 4.19,22.67 4.19,23.05 LED52.A 4.19,23.24 5.15,24.2 LED53.A 5.34,24.39 6.1,25.15 LED54.A 6.29,25.15 7.24,26.1 LED55.A 7.43,26.1 7.62,25.91 8.38,25.91 8.58,26.1 8.77,26.1 9.15,26.48 9.53,26.48 9.72,26.29 10.29,26.29 LED62.C 10.48,26.1 10.48,25.72 13.53,22.67 16.77,22.67 v17.72,21.72 | v24.01,10.86 23.81,10.67 23.81,10.48 23.43,10.1 23.43,9.72 24.01,9.15 25.53,9.15 LED21.C | v20.96,12.97 20.94,12.96 18.86,12.96 U2.2 | v21.53,22.1 21.63,22.2 24.85,22.2 LED13.C | v4.58,22.1 4.19,22.48 4,22.48 | v18.9,23.38 18.9,23.66 18.38,24.19 18.38,24.59 18.66,24.87 18.81,24.87 LED5.C
  Bottom 0.254: v19.81,3.43 11.62,3.43 9.91,5.15 9.91,5.91 10.29,6.29 10.29,7.62 9.53,8.38 v8.38,8.38 6.29,10.48 v5.15,10.48 5.15,11.24 2.86,13.53 2.86,20.39 v4.58,22.1 | v24.01,10.86 23.07,10.86 v20.96,12.97 20.96,20.6 20.86,20.6 | v21.53,22.1 21.43,22.1 20.86,21.53 20.86,20.6 | 20.86,20.6 18.83,20.6 v17.72,21.72 18.9,22.9 v18.9,23.38
B7  (via drill 0.25, 0.35)
  Top 0.254: v24.2,8.58 24.39,8.38 24.77,8.38 LED22.C | v23.24,5.34 22.48,5.34 22.29,5.53 LED30.C 20.83,7.01 20.29,7.01 | 4.96,9.34 LED46.C 5.62,9.99 LED71.C 6.3,9.84 v7.74,9.84 | LED38.C 7.24,6.48 7.9,7.14 7.9,8.58 8.27,8.96 8.51,8.96 | v8.38,24.01 7.43,24.01 LED54.C | LED63.A 8.58,27.05 9.34,27.05 9.72,27.43 LED62.A 9.91,27.43 10.29,27.05 v10.67,27.05 11.05,27.43 11.05,28.01 LED61.A 11.24,28.2 11.43,28.39 12.38,28.39 LED60.A | v12,25.72 13.34,24.39 15.05,24.39 LED57.A | v22.86,20.77 22.86,19.81 LED58.A | 8.51,8.96 8.58,8.96 8.96,8.58 8.96,7.43 9.34,7.05 10.1,7.05 10.48,6.67 10.67,6.67 10.86,6.48 15.05,6.48 LED56.A 19.86,6.54 20.29,6.97 20.29,7.01 | 8.51,8.96 v8.58,9.02 | 20.29,7.01 20.5,7.13 20.56,7.34 20.56,10.36 20.95,10.75 21,10.75 21.31,11.06 21.31,11.11 v21.59,11.39 | LED14.C 24.06,23.3 24.06,24.26 23.37,24.95 23.25,24.95 22.46,25.73 22.06,25.73 21.86,25.53 21.34,25.53 LED6.C 21.2,25.61 v21.2,26.41 | LED59.A 20.22,23.52 v20.22,23.56 | v22.1,12.96 21.82,12.96 21.35,12.49 20.76,12.49 20.75,12.5 20.64,12.5 | U2.1 20.64,12.5 | 20.64,12.5 20.77,12.37 v20.77,12.34
  Bottom 0.254: v24.2,8.58 24.77,8 25.53,8 25.72,7.81 25.72,6.67 24.39,5.34 v23.24,5.34 | v8.38,24.01 8.38,24.77 v10.67,27.05 v12,25.72 14.67,28.39 17.34,28.39 20.01,25.72 | 20.4,24 20.01,24.39 20.01,25.72 | 20.4,24 22.86,21.53 v22.86,20.77 21.91,19.81 21.91,17.15 23.1,15.96 23.1,13.96 v22.1,12.96 | v8.58,9.02 7.75,9.84 v7.74,9.84 | v21.2,26.41 20.51,25.72 20.01,25.72 | v20.22,23.56 20.4,23.73 20.4,24 | v20.77,12.34 21.59,11.53 v21.59,11.39
B8  (via drill 0.25, 0.35)
  Top 0.254: U2.48 17.98,10.41 19.27,9.12 | 19.27,9.12 19.27,7.92 LED70.A 19.43,7.62 19.05,7.24 18.48,7.24 18.29,7.43 11.43,7.43 | 19.27,9.12 19.27,9.14 19.58,9.45 19.58,10.08 v20.78,11.28 | LED39.C 6.48,7.43 5.72,8.19 LED47.C 5.8,8.44 7.14,8.44 8.64,9.94 8.64,10.67 | LED31.C 23.24,6.48 24.01,7.24 LED23.C 24.01,7.43 23.05,8.38 23.05,10.67 LED66.A | v24.2,14.48 24.2,15.05 LED64.A 21.43,15.24 v20.33,16.34 | v23.43,11.43 22.86,10.86 LED66.A | 11.43,7.43 10.86,7.43 LED69.A | LED63.C 9.15,25.72 8.38,24.96 LED55.C 8.38,24.77 9.6,23.55 | 9.6,23.55 10.1,23.05 10.67,23.05 LED68.A | 9.6,23.55 9.6,20.65 8.77,19.81 7.62,19.81 LED67.A 7.43,19.62 7.43,17.34 6.29,16.2 6.29,15.24 LED65.A 6.29,15.05 6.29,13.53 6.4,13.53 6.62,13.31 6.67,13.31 7.45,12.53 LED71.A 7.97,10.74 8.04,10.67 | v11.43,8.38 11.43,7.43 | 7.62,10.67 8.04,10.67 | 8.04,10.67 8.64,10.67 | v9.86,9.99 9.18,10.67 8.64,10.67 | 22.29,24.77 23.05,24.01 LED15.C | 22.29,24.77 LED7.C | LED66.A 22.78,10.49 22.59,10.49 22.46,10.36 v22.14,10.36 | v20.33,19.99 v20.33,21.14 | v20.71,22.63 20.71,23.3 20.99,23.57 20.99,23.89 21.87,24.77 22.29,24.77
  Bottom 0.254: v24.2,14.48 24.2,12.19 v23.43,11.43 | v9.86,9.99 9.86,9.75 11.22,8.38 v11.43,8.38 | v20.33,16.34 v20.33,19.99 | v20.33,21.14 20.33,22.24 v20.71,22.63 | v22.14,10.36 21.86,10.36 21.47,10.76 21.3,10.76 v20.78,11.28
BSL_RST  (via drill 0.35)
  Top 0.254: v18.64,7.84 13.99,7.84 R1.1 13.99,10.64 U2.40
  Bottom 0.254: TP6.TP 19.24,7.24 v18.64,7.84
BSL_RX  (via drill 0.35)
  Top 0.254: v19.86,15.04 19.8,14.99 U2.6
  Bottom 0.254: TP3.TP 21.91,9.24 21.15,9.99 20.62,9.99 19.86,10.76 19.86,14.11 20.07,14.32 20.07,14.56 19.86,14.77 v19.86,15.04
BSL_TEST  (via drill 0.35)
  Top 0.254: v18.74,8.52 18.61,8.39 v14.24,8.39 | v13.14,10.54 13.49,10.89 U2.39
  Bottom 0.254: TP5.TP 21.91,7.24 21.15,7.99 19.27,7.99 v18.74,8.52 | v14.24,8.39 12.94,9.69 12.94,10.34 v13.14,10.54
BSL_TX  (via drill 0.35)
  Top 0.254: v19.44,14.44 19.4,14.48 U2.5
  Bottom 0.254: TP4.TP 19.44,10.64 v19.44,14.44
BSL_VCC  (via drill 0.35)
  Top 0.254: v19.64,15.94 18.78,15.94 U2.8
  Bottom 0.254: TP2.TP 23.91,9.24 23.15,9.99 22.53,9.99 22.17,9.64 22.05,9.64 21.31,10.38 20.78,10.38 20.24,10.92 20.24,13.95 20.49,14.2 20.49,15.16 20.08,15.57 20.01,15.57 v19.64,15.94
BUTTON  (via drill 0.35)
  Top 0.254: U2.4 18.81,13.91 22.83,13.91 23.77,12.97 24.29,12.97 24.76,13.44 25.74,13.44 v26.24,13.94
  Bottom 0.254: S2.2 26.89,13.29 v26.24,13.94
GND  (via drill 0.25, 0.35)
  Top 0.254: 8.29,15.95 8.16,15.95 8.01,16.1 8.01,16.39 U1.12 8.01,16.54 8.01,16.87 8.39,17.25 C7.2 8.58,18.29 12.58,22.29 16.38,22.29 17.53,21.15 17.83,21.15 18.2,21.52 18.2,21.8 18.44,22.04 18.95,22.04 19.28,21.72 20.65,21.72 21.05,21.32 21.05,21.14 21.33,20.86 21.51,20.86 21.84,20.53 21.84,19.69 22.67,18.86 23.24,18.86 24.96,17.15 v26.1,17.15 | 8.29,15.95 v8.44,15.8 | v9.88,14.01 U1.5 9.44,13.49 9.47,13.46 9.47,13.02 9.44,12.99 9.44,12.89 C6.2 10.1,12.19 10.29,12 v11.05,12 | U1.10 8.89,16.42 8.89,16.12 8.72,15.95 8.29,15.95 | U1.7 9.59,15.17 9.3,15.17 9.15,15.02 9.15,15.01 v9,14.86 | U2.42 15.05,11.81 15.05,11.94 15.05,12.13 | U$1.- 15.24,12.42 15.05,12.24 15.05,12.13 | v14.24,12.94 15.05,12.13
  Bottom 0.254: U$1.- 16.84,15.24 19.06,13.02 19.06,9.96 20.53,8.49 23.59,8.49 TP1.TP | v9.88,14.01 9,14.89 | 9,14.89 8.44,15.45 v8.44,15.8 | 9,14.89 v9,14.86 | v26.1,17.15 27.82,17.15 S2.1 | v11.05,12 14.1,15.05 15.05,15.05 U$1.- | U$1.- 15.24,13.94 v14.24,12.94
IMU_INT  (via drill 0.35)
  Top 0.254: U1.11 8.51,16.54 8.51,16.83 8.66,16.98 10.49,16.98 v10.64,17.13 | v18.94,18.54 18.16,18.54 U2.13
  Bottom 0.254: v10.64,17.13 12.04,17.13 14.04,19.13 15.66,19.13 16.25,18.54 v18.94,18.54
IMU_SCL  (via drill 0.35)
  Top 0.254: U1.4 v8.94,13.24 | v19.64,17.62 19.52,17.5 U2.11
  Bottom 0.254: v8.94,13.24 9.94,13.24 10.41,13.71 10.41,14.96 14.2,18.75 15.5,18.75 16.63,17.62 v19.64,17.62
IMU_SDA  (via drill 0.35)
  Top 0.254: U1.6 v10.94,14.74 | v19.74,16.94 18.77,16.94 U2.10
  Bottom 0.254: v19.74,16.94 16.77,16.94 15.35,18.37 14.57,18.37 v10.94,14.74
VCC  (via drill 0.25, 0.35)
  Top 0.254: U2.41 14.4,11.68 14.4,10.51 13.89,10 R1.2 14.96,10.31 v14.96,10.64 | v17.16,10.77 16.83,11.1 16.73,11.1 16.48,11.35 U2.45 | 8.22,15.27 8.66,15.27 9.13,15.74 U1.8 10.06,16.14 v10.14,16.14 | U1.14 7.75,15.74 8.22,15.27 | 8.22,15.27 8.21,15.27 v7.88,14.94 | v6.84,13.84 7.02,14.01 U1.1 7.44,13.19 C6.1 8.68,12.24 9.44,11.49 10.18,11.49 v10.44,11.23 10.44,10.9 11.24,10.1 11.24,9.34 v9.53,7.62 | v10.06,17.52 10.06,18.22 C7.1
  Bottom 0.254: v17.16,10.77 15.09,10.77 v14.96,10.64 14.86,10.67 14.48,10.67 13.92,11.23 v10.44,11.23 | v7.88,14.94 6.84,13.9 v6.84,13.84 | v10.14,16.14 10.06,16.22 v10.06,17.52 | v9.53,7.62 7.62,7.62 6.29,6.29 U$1.+$1
XIN
  Top 0.254: X1.2 16,11.18 U2.44
XOUT
  Top 0.254: X1.1 15.49,10.29 U2.43

### Text on the board
tNames: RX | TX | GND | TEST | RST | VCC | 11 | 01 | v0.3 | 10 | 02 | 09 | 03 | 08 | 04 | 07 | 05
Document: Don't forget change dimension circle to 0.5642